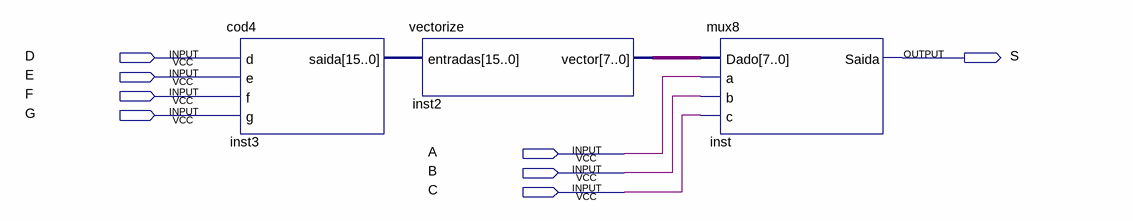
[diagram p0: schematic sheet]
// Quartus schematic Exp53.bdf as structural Verilog: 3 symbols, 8 pins
module Exp53 (
  input  D,
  input  E,
  input  F,
  input  G,
  input  A,
  input  B,
  input  C,
  output S
);

  wire [7:0] inst2_vector;
  wire [15:0] inst3_saida;

  cod4 inst3 (.d(D), .e(E), .f(F), .g(G), .saida(inst3_saida));
  vectorize inst2 (.entradas(inst3_saida), .vector(inst2_vector));
  mux8 inst (.Dado(inst2_vector), .a(A), .b(B), .c(C), .Saida(S));
endmodule
